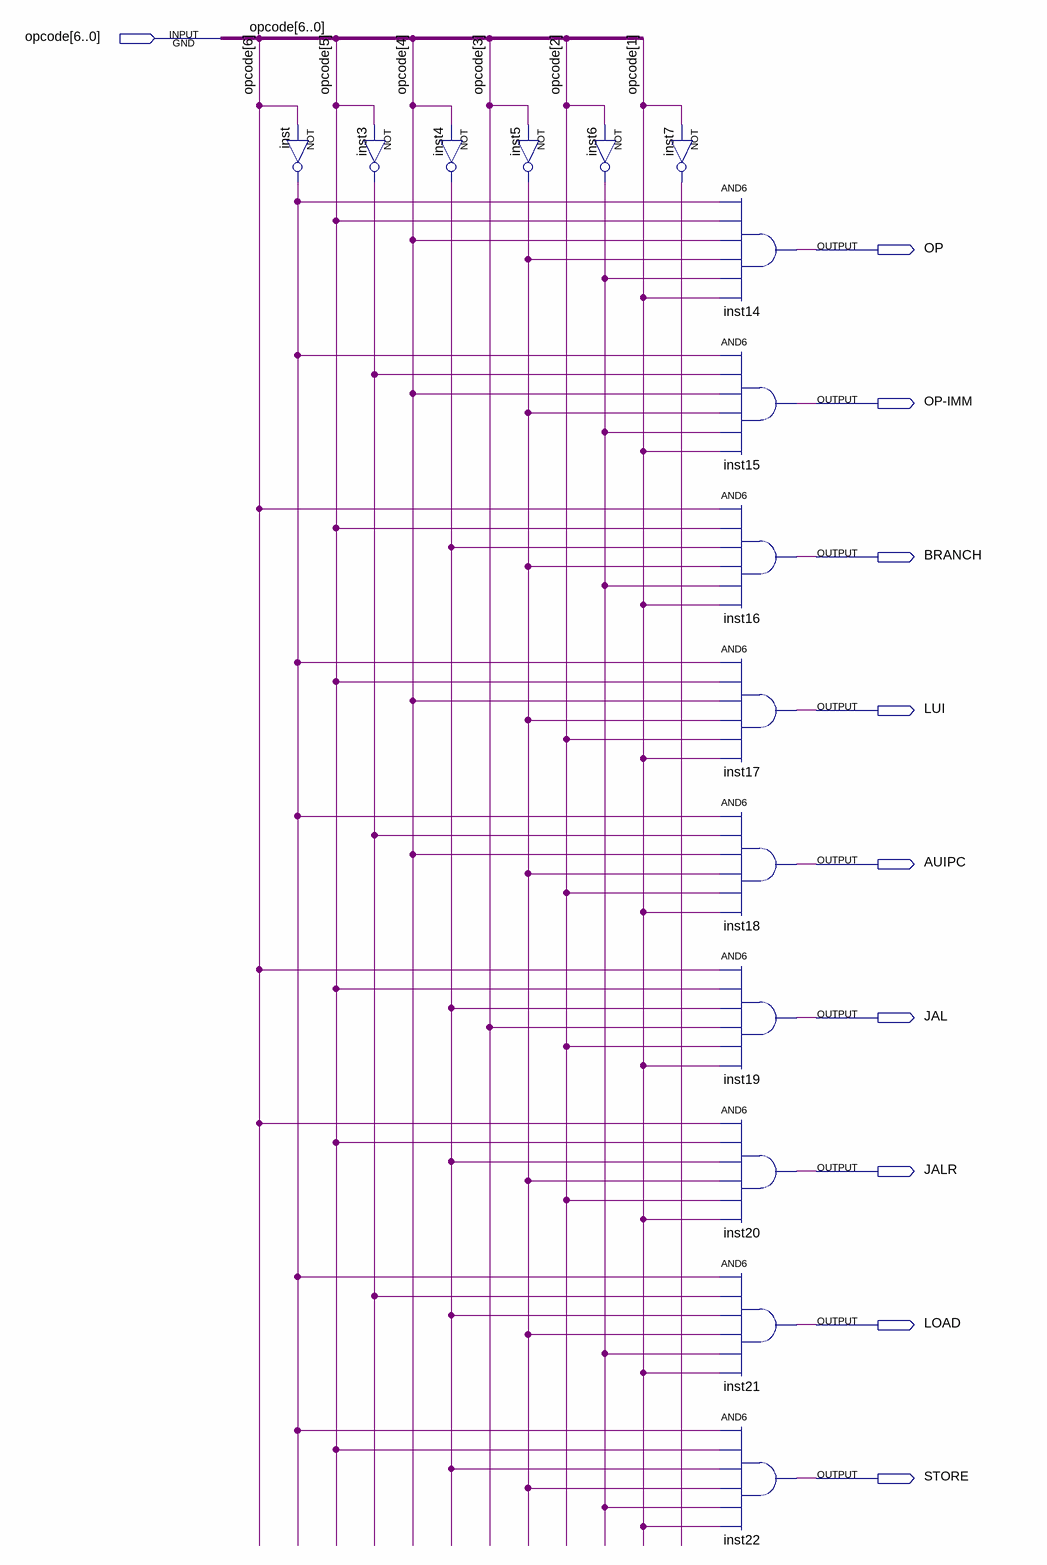
[diagram p0: schematic sheet]
// Quartus schematic instrdc.bdf as structural Verilog: 15 symbols, 10 pins
module instrdc (
  input  [6:0] opcode,
  output OP,
  output \OP-IMM ,
  output BRANCH,
  output LUI,
  output AUIPC,
  output JAL,
  output JALR,
  output LOAD,
  output STORE
);

  wire inst3_out, inst4_out, inst5_out, inst6_out, inst7_out, inst_out;

  not inst (inst_out, opcode[6]);
  not inst3 (inst3_out, opcode[5]);
  not inst4 (inst4_out, opcode[4]);
  not inst5 (inst5_out, opcode[3]);
  not inst6 (inst6_out, opcode[2]);
  not inst7 (inst7_out, opcode[1]);
  and inst14 (OP, inst_out, opcode[5], opcode[4], inst5_out, inst6_out, opcode[1]);
  and inst15 (\OP-IMM , inst_out, inst3_out, opcode[4], inst5_out, inst6_out, opcode[1]);
  and inst16 (BRANCH, opcode[6], opcode[5], inst4_out, inst5_out, inst6_out, opcode[1]);
  and inst17 (LUI, inst_out, opcode[5], opcode[4], inst5_out, opcode[2], opcode[1]);
  and inst18 (AUIPC, inst_out, inst3_out, opcode[4], inst5_out, opcode[2], opcode[1]);
  and inst19 (JAL, opcode[6], opcode[5], inst4_out, opcode[3], opcode[2], opcode[1]);
  and inst20 (JALR, opcode[6], opcode[5], inst4_out, inst5_out, opcode[2], opcode[1]);
  and inst21 (LOAD, inst_out, inst3_out, inst4_out, inst5_out, inst6_out, opcode[1]);
  and inst22 (STORE, inst_out, opcode[5], inst4_out, inst5_out, inst6_out, opcode[1]);
endmodule
